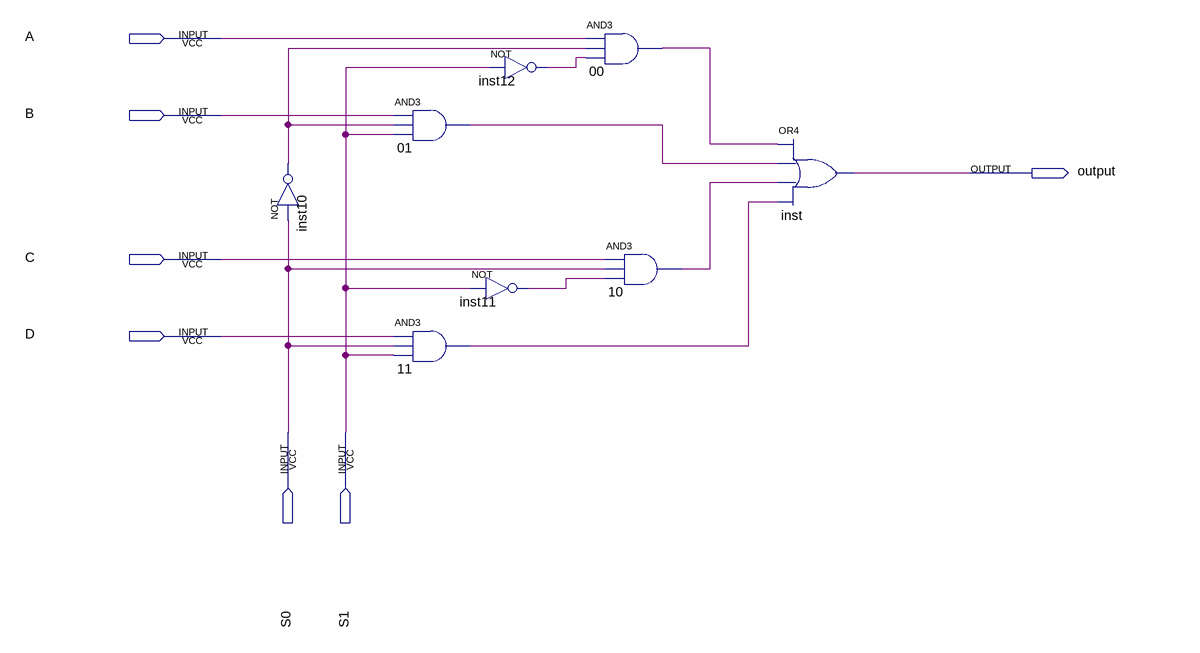
[diagram p0: schematic sheet]
// Quartus schematic MUX_3pra1.bdf as structural Verilog: 8 symbols, 7 pins
module MUX_3pra1 (
  input  A,
  input  B,
  input  C,
  input  D,
  input  S0,
  input  S1,
  output \output 
);

  wire inst10_out, inst11_out, inst12_out, n00_out, n01_out, n10_out, n11_out;

  not inst10 (inst10_out, S0);
  and u_01 (n01_out, B, inst10_out, S1);
  and u_11 (n11_out, D, S0, S1);
  not inst12 (inst12_out, S1);
  not inst11 (inst11_out, S1);
  and u_00 (n00_out, A, inst10_out, inst12_out);
  and u_10 (n10_out, C, S0, inst11_out);
  or inst (\output , n00_out, n01_out, n10_out, n11_out);
endmodule
